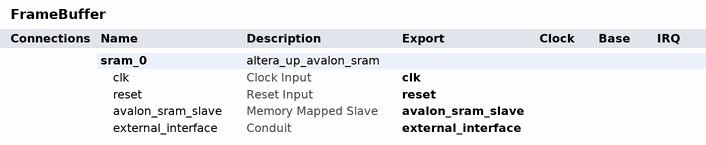
[diagram p0: system contents]
# Platform Designer (Qsys) system FrameBuffer, Cyclone IV E EP4CE115F29C7
# Parameters at their usual value, and those the tool derives, are not listed.
package require -exact qsys 16.1
create_system FrameBuffer
set_project_property DEVICE_FAMILY {Cyclone IV E}
set_project_property DEVICE EP4CE115F29C7

add_instance sram_0 altera_up_avalon_sram 16.1
set_instance_property sram_0 AUTO_EXPORT true
set_instance_parameter_value sram_0 board DE2-115
set_instance_parameter_value sram_0 pixel_buffer true

# exported interfaces
add_interface avalon_sram_slave avalon slave
set_interface_property avalon_sram_slave EXPORT_OF sram_0.avalon_sram_slave
add_interface clk clock sink
set_interface_property clk EXPORT_OF sram_0.clk
add_interface external_interface conduit end
set_interface_property external_interface EXPORT_OF sram_0.external_interface
add_interface reset reset sink
set_interface_property reset EXPORT_OF sram_0.reset

set_interconnect_requirement {$system} qsys_mm.clockCrossingAdapter HANDSHAKE
set_interconnect_requirement {$system} qsys_mm.enableEccProtection FALSE
set_interconnect_requirement {$system} qsys_mm.insertDefaultSlave FALSE
set_interconnect_requirement {$system} qsys_mm.maxAdditionalLatency 1

save_system FrameBuffer.qsys
